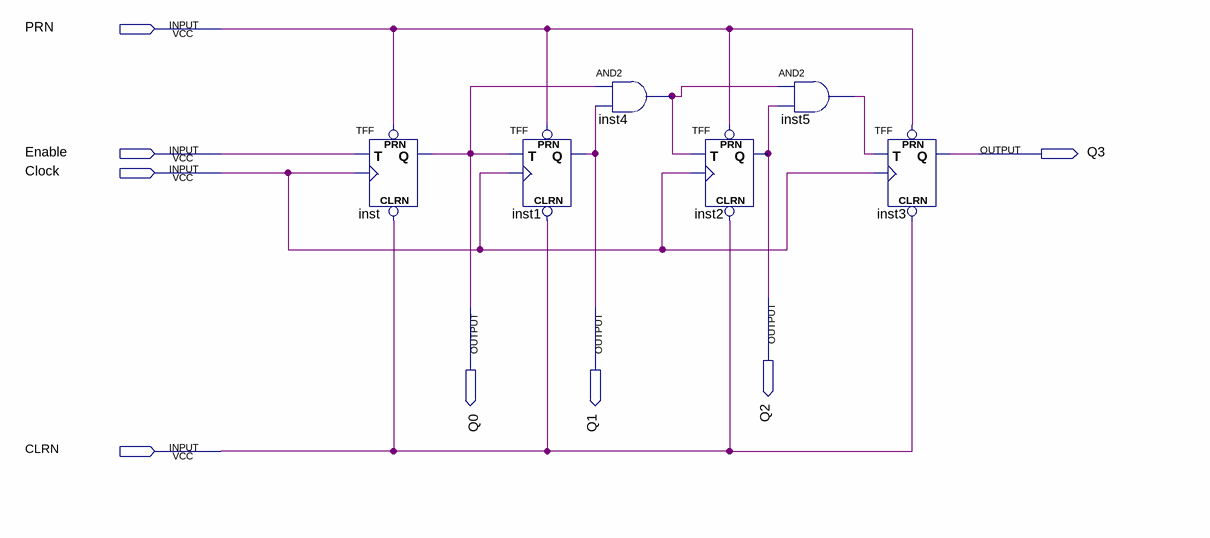
[diagram p0: schematic sheet]
// Quartus schematic lab10step2b.bdf as structural Verilog: 6 symbols, 8 pins
module lab10step2b (
  input  PRN,
  input  Enable,
  input  Clock,
  input  CLRN,
  output Q3,
  output Q2,
  output Q0,
  output Q1
);

  wire inst4_out, inst5_out;

  TFF inst (.PRN(PRN), .CLRN(CLRN), .T(Enable), .CLK(Clock), .Q(Q0));
  TFF inst1 (.PRN(PRN), .CLRN(CLRN), .T(Q0), .CLK(Clock), .Q(Q1));
  and inst4 (inst4_out, Q0, Q1);
  TFF inst2 (.PRN(PRN), .CLRN(CLRN), .T(inst4_out), .CLK(Clock), .Q(Q2));
  and inst5 (inst5_out, inst4_out, Q2);
  TFF inst3 (.PRN(PRN), .CLRN(CLRN), .T(inst5_out), .CLK(Clock), .Q(Q3));
endmodule
